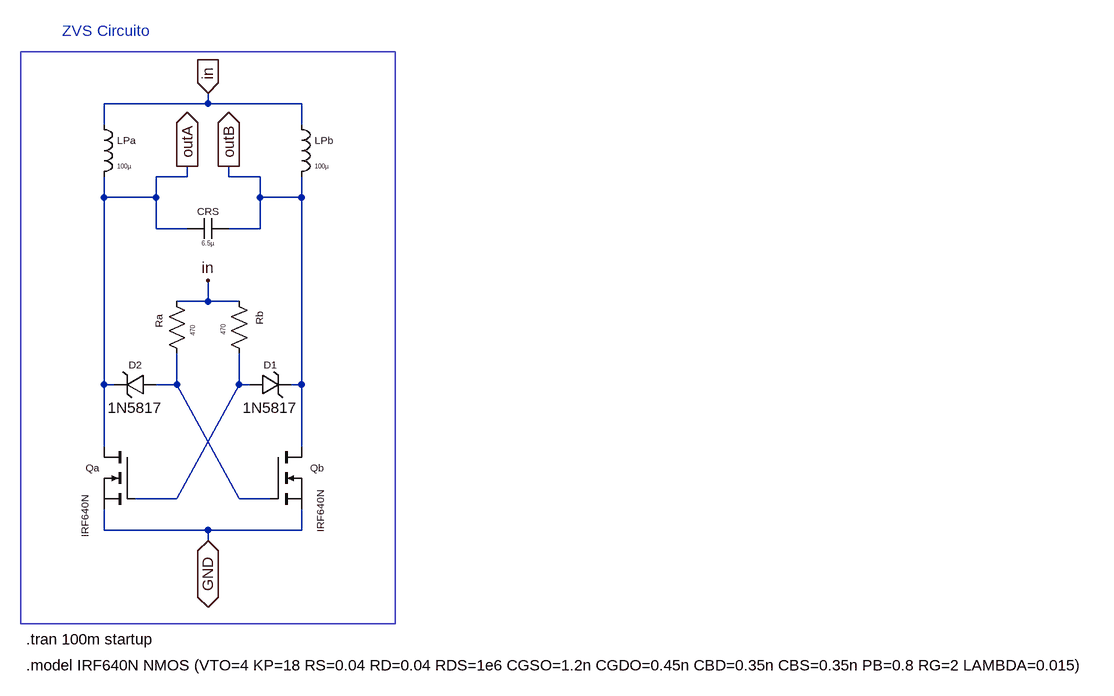
[diagram p0: schematic zns.asc]
zns.asc, the LTspice schematic file:
Version 4.1
SHEET 1 1776 816
WIRE 304 -64 304 -80
WIRE 304 -64 144 -64
WIRE 448 -64 304 -64
WIRE 144 -32 144 -64
WIRE 448 -32 448 -64
WIRE 272 48 272 32
WIRE 272 48 224 48
WIRE 336 48 336 32
WIRE 384 48 336 48
WIRE 144 80 144 48
WIRE 224 80 224 48
WIRE 224 80 144 80
WIRE 384 80 384 48
WIRE 448 80 448 48
WIRE 448 80 384 80
WIRE 224 128 224 80
WIRE 272 128 224 128
WIRE 384 128 384 80
WIRE 384 128 336 128
WIRE 304 240 304 208
WIRE 304 240 256 240
WIRE 352 240 304 240
WIRE 144 368 144 80
WIRE 160 368 144 368
WIRE 256 368 256 320
WIRE 256 368 224 368
WIRE 352 368 352 320
WIRE 368 368 352 368
WIRE 448 368 448 80
WIRE 448 368 432 368
WIRE 144 464 144 368
WIRE 448 464 448 368
WIRE 256 544 352 368
WIRE 256 544 192 544
WIRE 352 544 256 368
WIRE 400 544 352 544
WIRE 144 592 144 560
WIRE 304 592 144 592
WIRE 448 592 448 560
WIRE 448 592 304 592
WIRE 304 608 304 592
FLAG 304 208 in
FLAG 304 -80 in
IOPIN 304 -80 In
FLAG 304 608 GND
IOPIN 304 608 BiDir
FLAG 272 32 outA
IOPIN 272 32 Out
FLAG 336 32 outB
IOPIN 336 32 Out
SYMBOL cap 336 112 R90
WINDOW 0 0 32 VBottom 1
WINDOW 3 32 32 VTop 0
SYMATTR InstName CRS
SYMATTR Value 6.5µ
SYMBOL ind 128 -48 R0
WINDOW 0 36 40 Left 1
WINDOW 3 36 80 Left 0
SYMATTR InstName LPa
SYMATTR Value 100µ
SYMATTR SpiceLine Rser=1m
SYMBOL ind 432 -48 R0
WINDOW 0 36 40 Left 1
WINDOW 3 36 80 Left 0
SYMATTR InstName LPb
SYMATTR Value 100µ
SYMATTR SpiceLine Rser=1m
SYMBOL res 240 224 R0
WINDOW 0 -11 47 VCenter 1
WINDOW 3 41 70 VLeft 0
SYMATTR InstName Ra
SYMATTR Value 470
SYMBOL res 336 224 R0
WINDOW 0 47 42 VCenter 1
WINDOW 3 -8 68 VLeft 0
SYMATTR InstName Rb
SYMATTR Value 470
SYMBOL nmos 400 464 R0
WINDOW 0 72 32 Center 1
WINDOW 3 77 100 VCenter 1
SYMATTR InstName Qb
SYMATTR Value IRF640N
SYMBOL zener 368 384 R270
WINDOW 0 36 32 VTop 1
WINDOW 3 -4 32 VBottom 2
SYMATTR InstName D1
SYMATTR Value 1N5817
SYMBOL zener 224 352 R90
WINDOW 0 -4 32 VBottom 1
WINDOW 3 36 32 VTop 2
SYMATTR InstName D2
SYMATTR Value 1N5817
SYMBOL nmos 192 464 M0
WINDOW 0 65 32 Center 1
WINDOW 3 77 107 VCenter 1
SYMATTR InstName Qa
SYMATTR Value IRF640N
TEXT 80 -176 Left 2 ;ZVS Circuito
TEXT 24 760 Left 2 !.tran 100m startup
TEXT 24 800 Left 2 !.model IRF640N NMOS (VTO=4 KP=18 RS=0.04 RD=0.04 RDS=1e6 CGSO=1.2n CGDO=0.45n CBD=0.35n CBS=0.35n PB=0.8 RG=2 LAMBDA=0.015)
RECTANGLE Normal 592 736 16 -144

The netlist it stands for:
* zns.asc
CRS outB outA 6.5µ
LPa in outA 100µ Rser=1m
LPb in outB 100µ Rser=1m
Ra in N001 470
Rb in N002 470
M§Qb outB N001 GND GND IRF640N
D1 N002 outB 1N5817
D2 N001 outA 1N5817
M§Qa outA N002 GND GND IRF640N
.model D D
.lib standard.dio
.model NMOS NMOS
.model PMOS PMOS
.lib standard.mos
* ZVS Circuito
.tran 100m startup
.model IRF640N NMOS (VTO=4 KP=18 RS=0.04 RD=0.04 RDS=1e6 CGSO=1.2n CGDO=0.45n CBD=0.35n CBS=0.35n PB=0.8 RG=2 LAMBDA=0.015)
.backanno
.end